# Altium project PCBVisor.PrjPcb
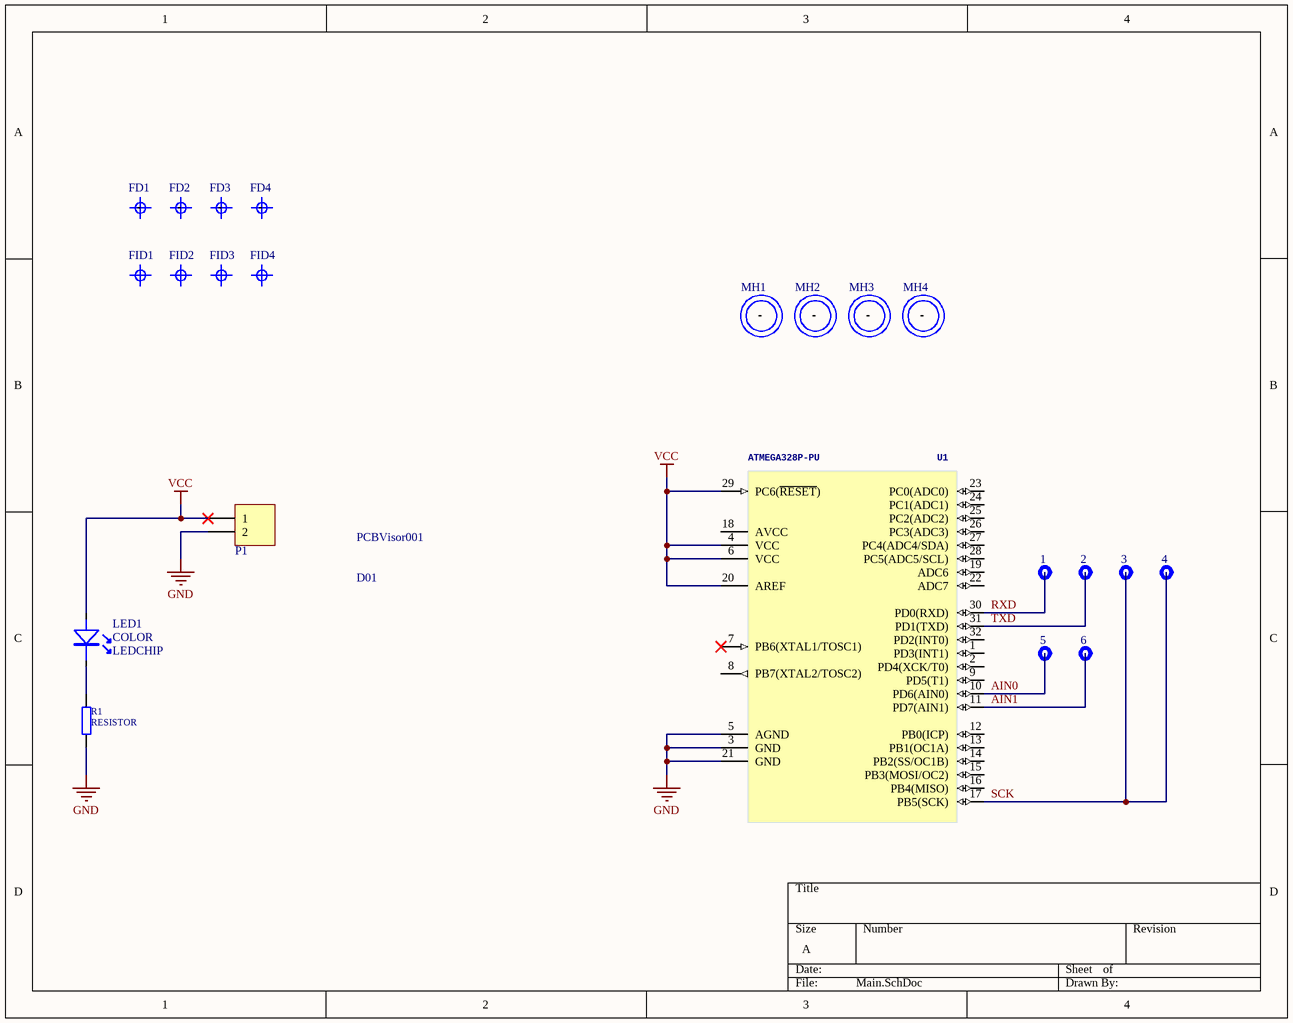
[diagram p0: Main.SchDoc]
PCB_NO: PCBVisor001; PCB_REV: D01
1 sheet, 22 parts. Net scope: global (net labels, ports and power ports of the same name join across sheets).
Board file: PCB1.PcbDoc

## Sheet Main.SchDoc
size A; SheetNumber: 1; SheetTotal: 1

### Parts
1  Test Point  [TEST_POINT]  (value not drawn)  (no BOM)
2  Test Point  [TEST_POINT]  (value not drawn)  (no BOM)
3  Test Point  [TEST_POINT]  (value not drawn)  (no BOM)
4  Test Point  [TEST_POINT]  (value not drawn)  (no BOM)
5  Test Point  [TEST_POINT]  (value not drawn)  (no BOM)
6  Test Point  [TEST_POINT]  (value not drawn)  (no BOM)
FD1  Global Fiducial Mark  [FIDUCIAL_0.8MM]  (value not drawn)
FD2  Global Fiducial Mark  [FIDUCIAL_0.8MM]  (value not drawn)
FD3  Global Fiducial Mark  [FIDUCIAL_0.8MM]  (value not drawn)
FD4  Global Fiducial Mark  [FIDUCIAL_0.8MM]  (value not drawn)
FID1  Global Fiducial Mark  [FIDUCIAL_0.8MM]  (value not drawn)
FID2  Global Fiducial Mark  [FIDUCIAL_0.8MM]  (value not drawn)
FID3  Global Fiducial Mark  [FIDUCIAL_0.8MM]  (value not drawn)
FID4  Global Fiducial Mark  [FIDUCIAL_0.8MM]  (value not drawn)
LED1  LEDCHIP  value COLOR  [CHIP-LED0603]
MH1  Mounting Hole  [MOUNTING_HOLE_3MM]  (value not drawn)  (no BOM)
MH2  Mounting Hole  [MOUNTING_HOLE_3MM]  (value not drawn)  (no BOM)
MH3  Mounting Hole  [MOUNTING_HOLE_3MM]  (value not drawn)  (no BOM)
MH4  Mounting Hole  [MOUNTING_HOLE_3MM]  (value not drawn)  (no BOM)
P1  Header 2  [JST-PH-2PIN-2.54-THM]  (value not drawn)
R1  RESISTOR  [R0603]
U1  ATMEGA328P-PU  [TQFP32-08]

### Nets
GND: P1.2 R1.2 U1.3(GND) U1.5(AGND) U1.21(GND)
VCC: LED1.A P1.1 U1.4(VCC) U1.6(VCC) U1.20(AREF) U1.29(PC6(~{RESET}))
AIN0: 5.1 U1.10(PD6(AIN0))
AIN1: 6.1 U1.11(PD7(AIN1))
RXD: 1.1 U1.30(PD0(RXD))
SCK: 3.1 4.1 U1.17(PB5(SCK))
TXD: 2.1 U1.31(PD1(TXD))
NetLED1_C: LED1.C(K) R1.1

Not connected (* = marked no-connect by the designer): FD1 0; FD2 0; FD3 0; FD4 0; MH1 0; MH2 0; MH3 0; MH4 0; U1 1(PD3(INT1)) 2(PD4(XCK/T0)) 7(PB6(XTAL1/TOSC1))* 8(PB7(XTAL2/TOSC2)) 9(PD5(T1)) 12(PB0(ICP)) 13(PB1(OC1A)) 14(PB2(SS/OC1B)) 15(PB3(MOSI/OC2)) 16(PB4(MISO)) 18(AVCC) 19(ADC6) 22(ADC7) 23(PC0(ADC0)) 24(PC1(ADC1)) 25(PC2(ADC2)) 26(PC3(ADC3)) 27(PC4(ADC4/SDA)) 28(PC5(ADC5/SCL)) 32(PD2(INT0))

### Library data of the parts
1-6 = TP
FD1-FD4 = FD
FID1-FID4 = FID
LED1 = LEDCHIP: SMD lamp beads
MH1-MH4 = MH
P1 = JST-PH-2PIN-2.54-THM: Header, 2-Pin; LatestRevisionDate: 17-Jul-2002; LatestRevisionNote: Re-released for DXP Platform.; Publisher: Altium Limited
R1 = RESISTOR: Resistor ?K ±0.1% 0.1W
U1 = ATMEGA328P-PU: GateName_1: G$1; SymbolName_1: ATMEGA168; LibraryName: SparkFun; DeviceSetName: ATMEGA168; Package: TQFP32-08